# Altium schematic sheet 0001_TITLE.SchDoc
size 848 x 558 mm
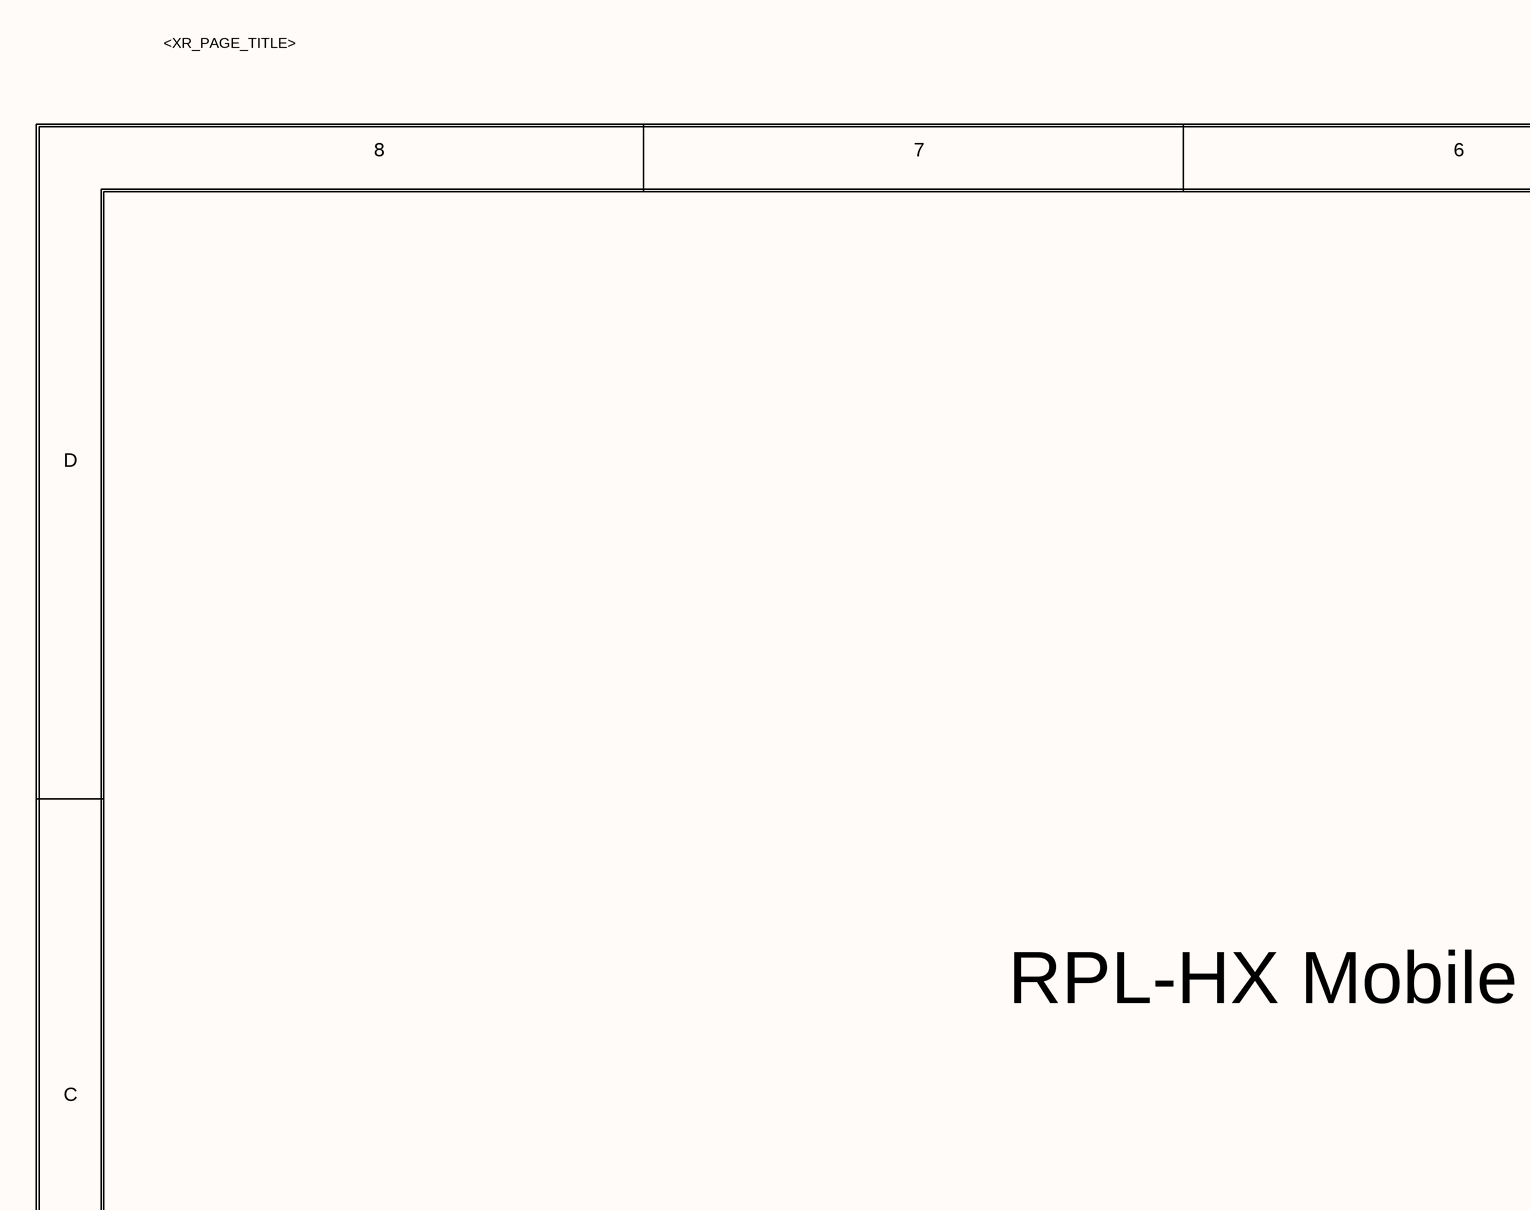
[diagram p0: 0001_TITLE.SchDoc, top left]
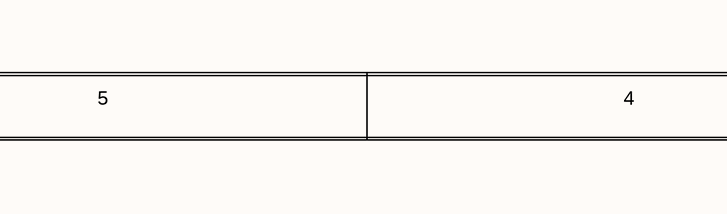
[diagram p1: 0001_TITLE.SchDoc, top middle]
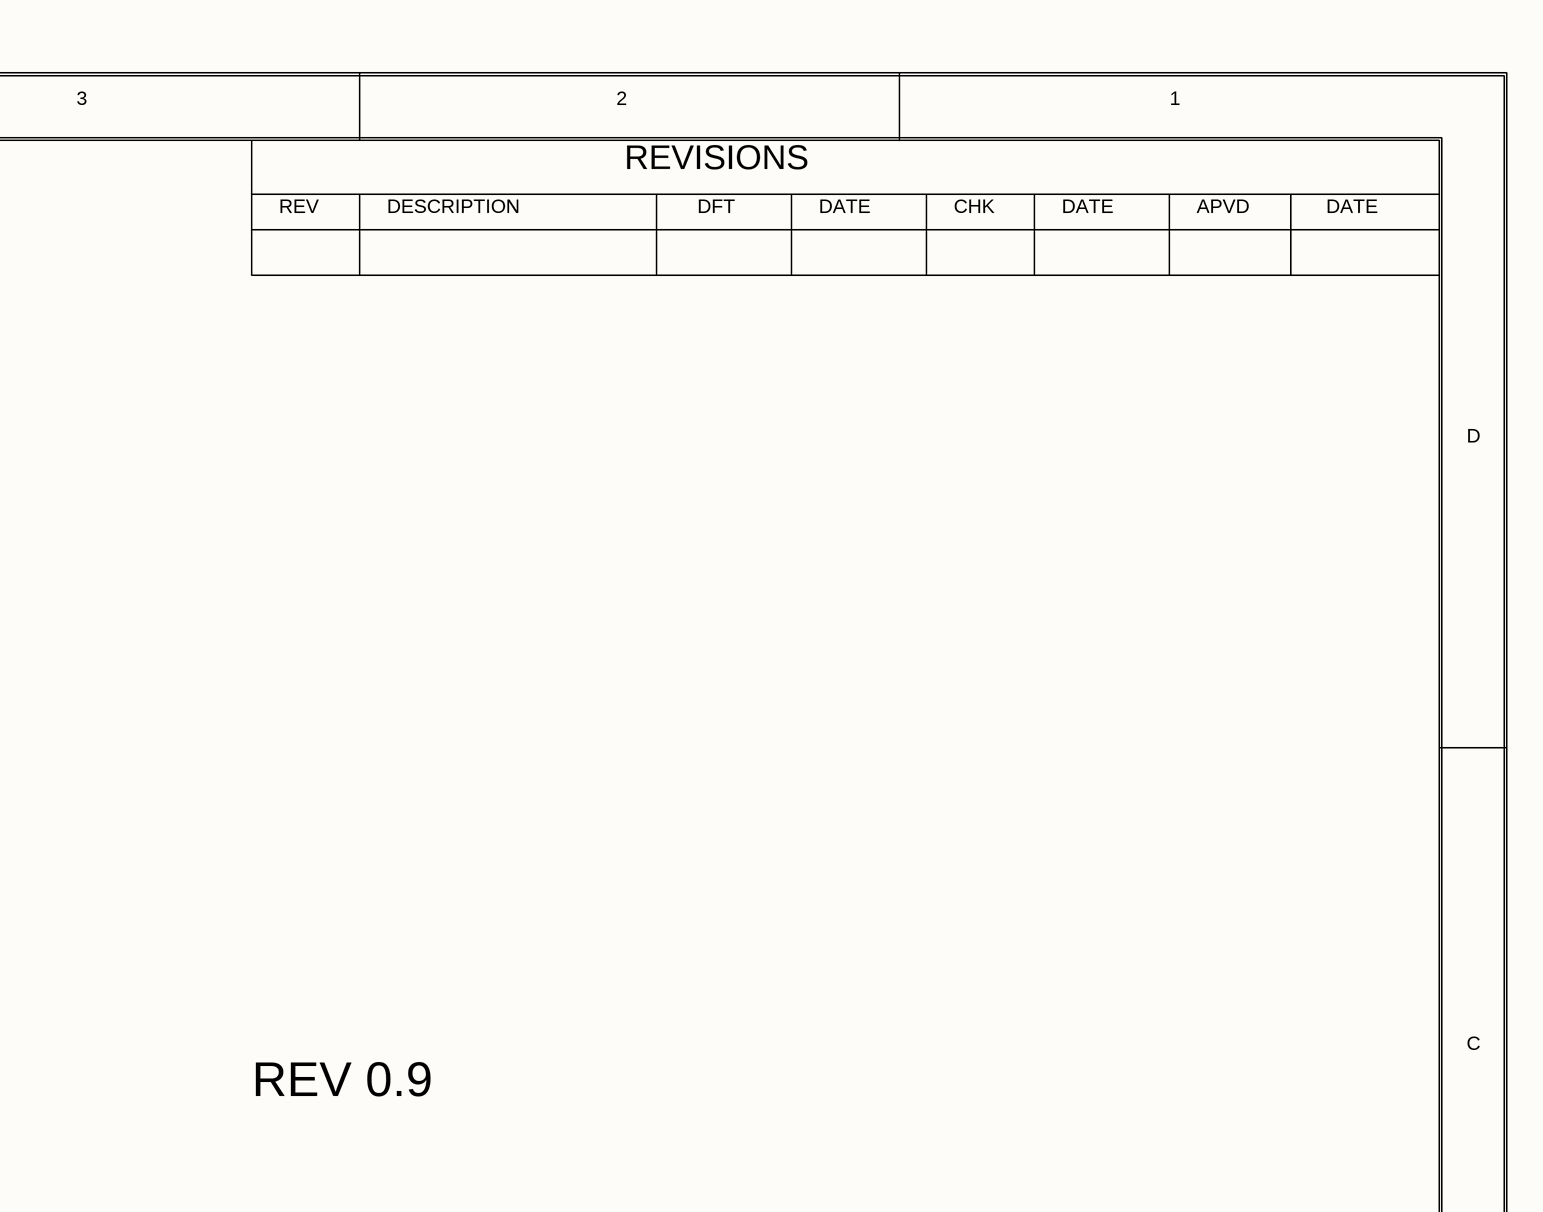
[diagram p2: 0001_TITLE.SchDoc, top right]
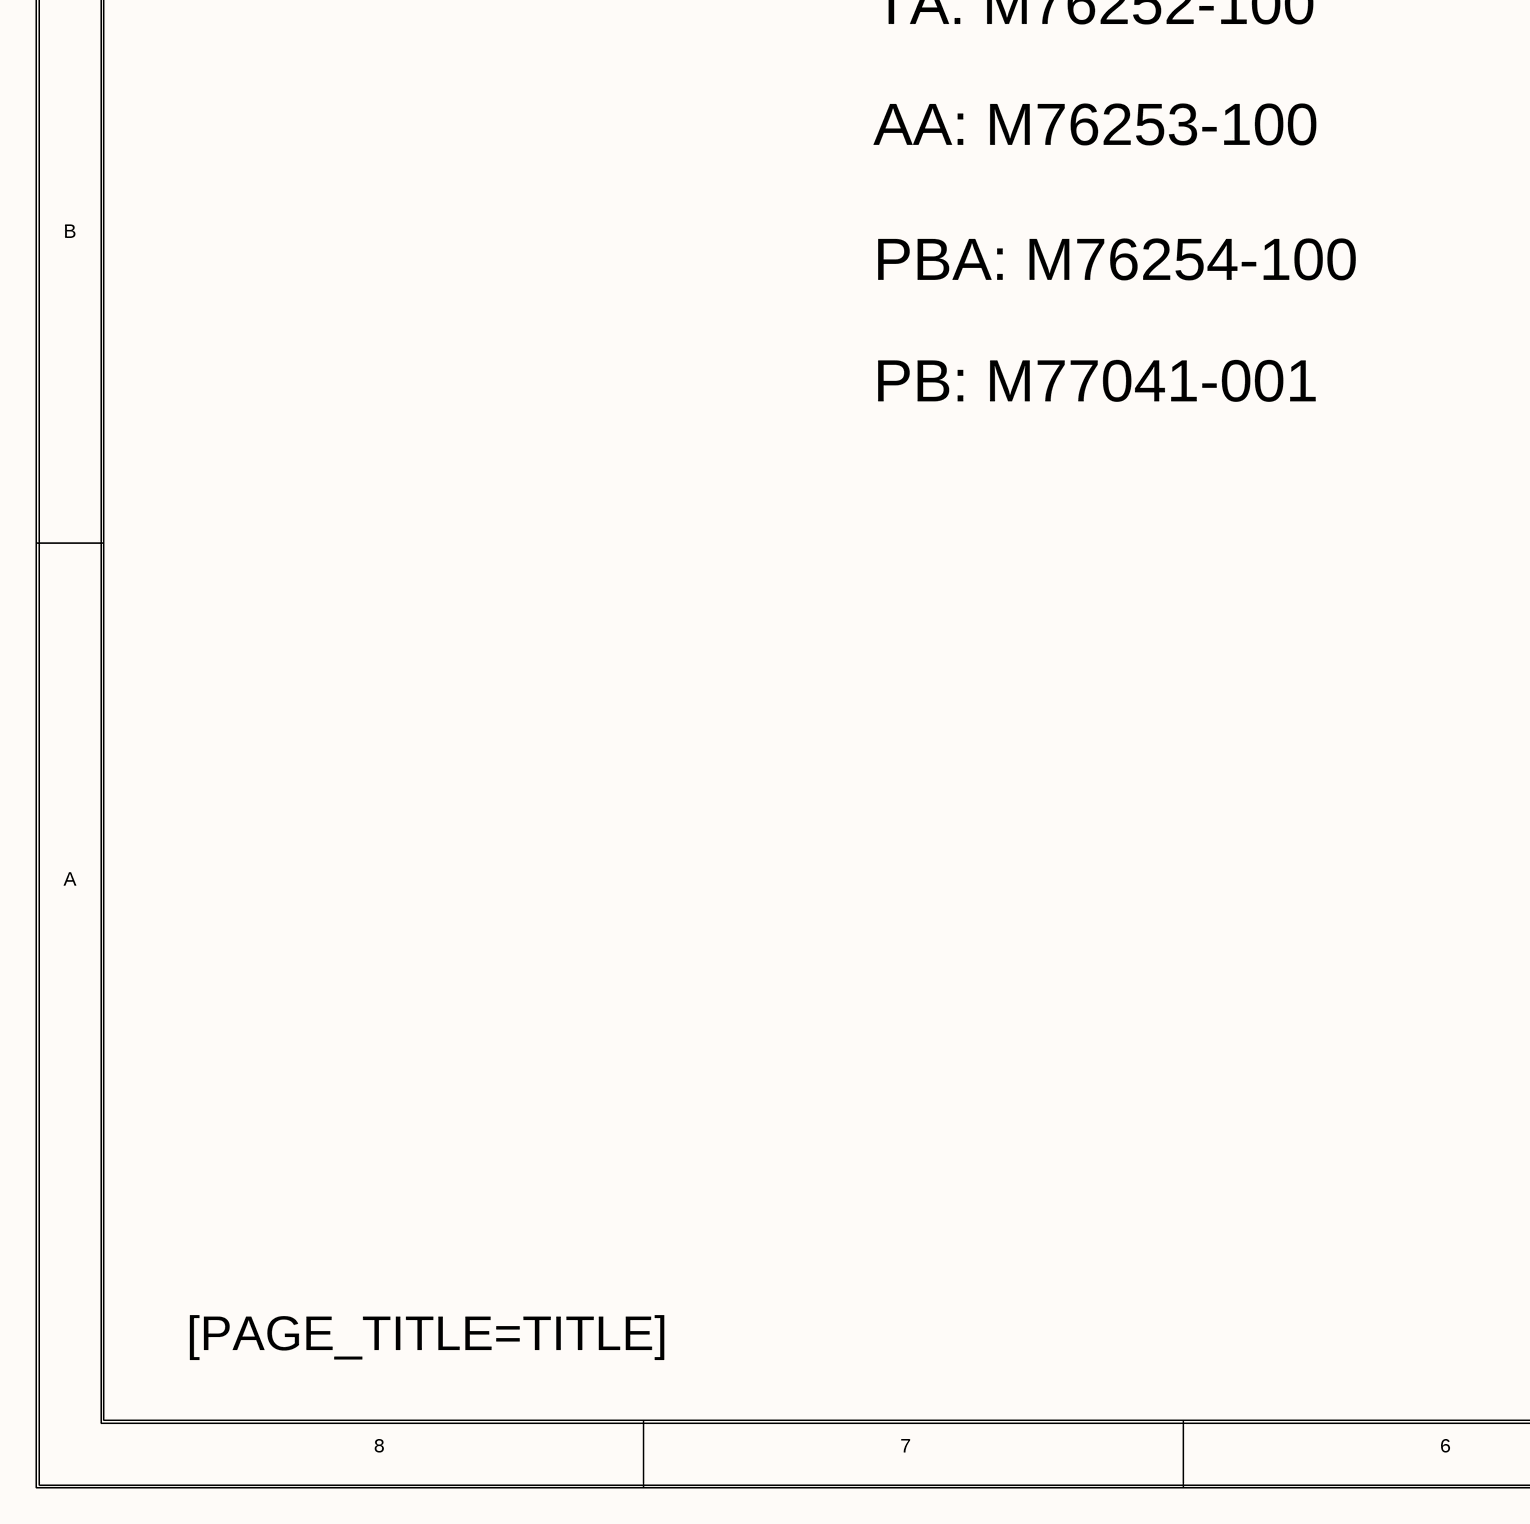
[diagram p3: 0001_TITLE.SchDoc, bottom left]
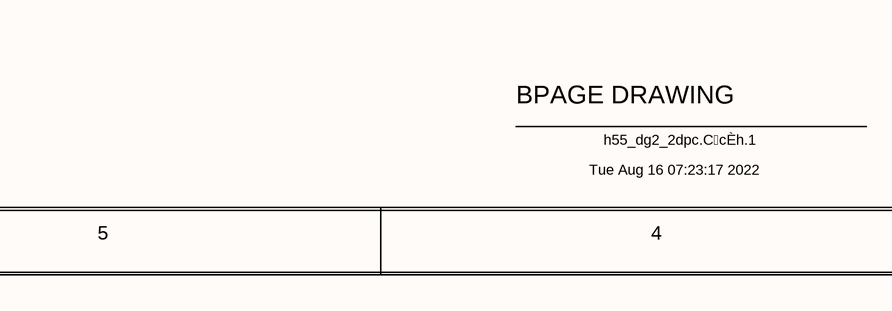
[diagram p4: 0001_TITLE.SchDoc, bottom middle]
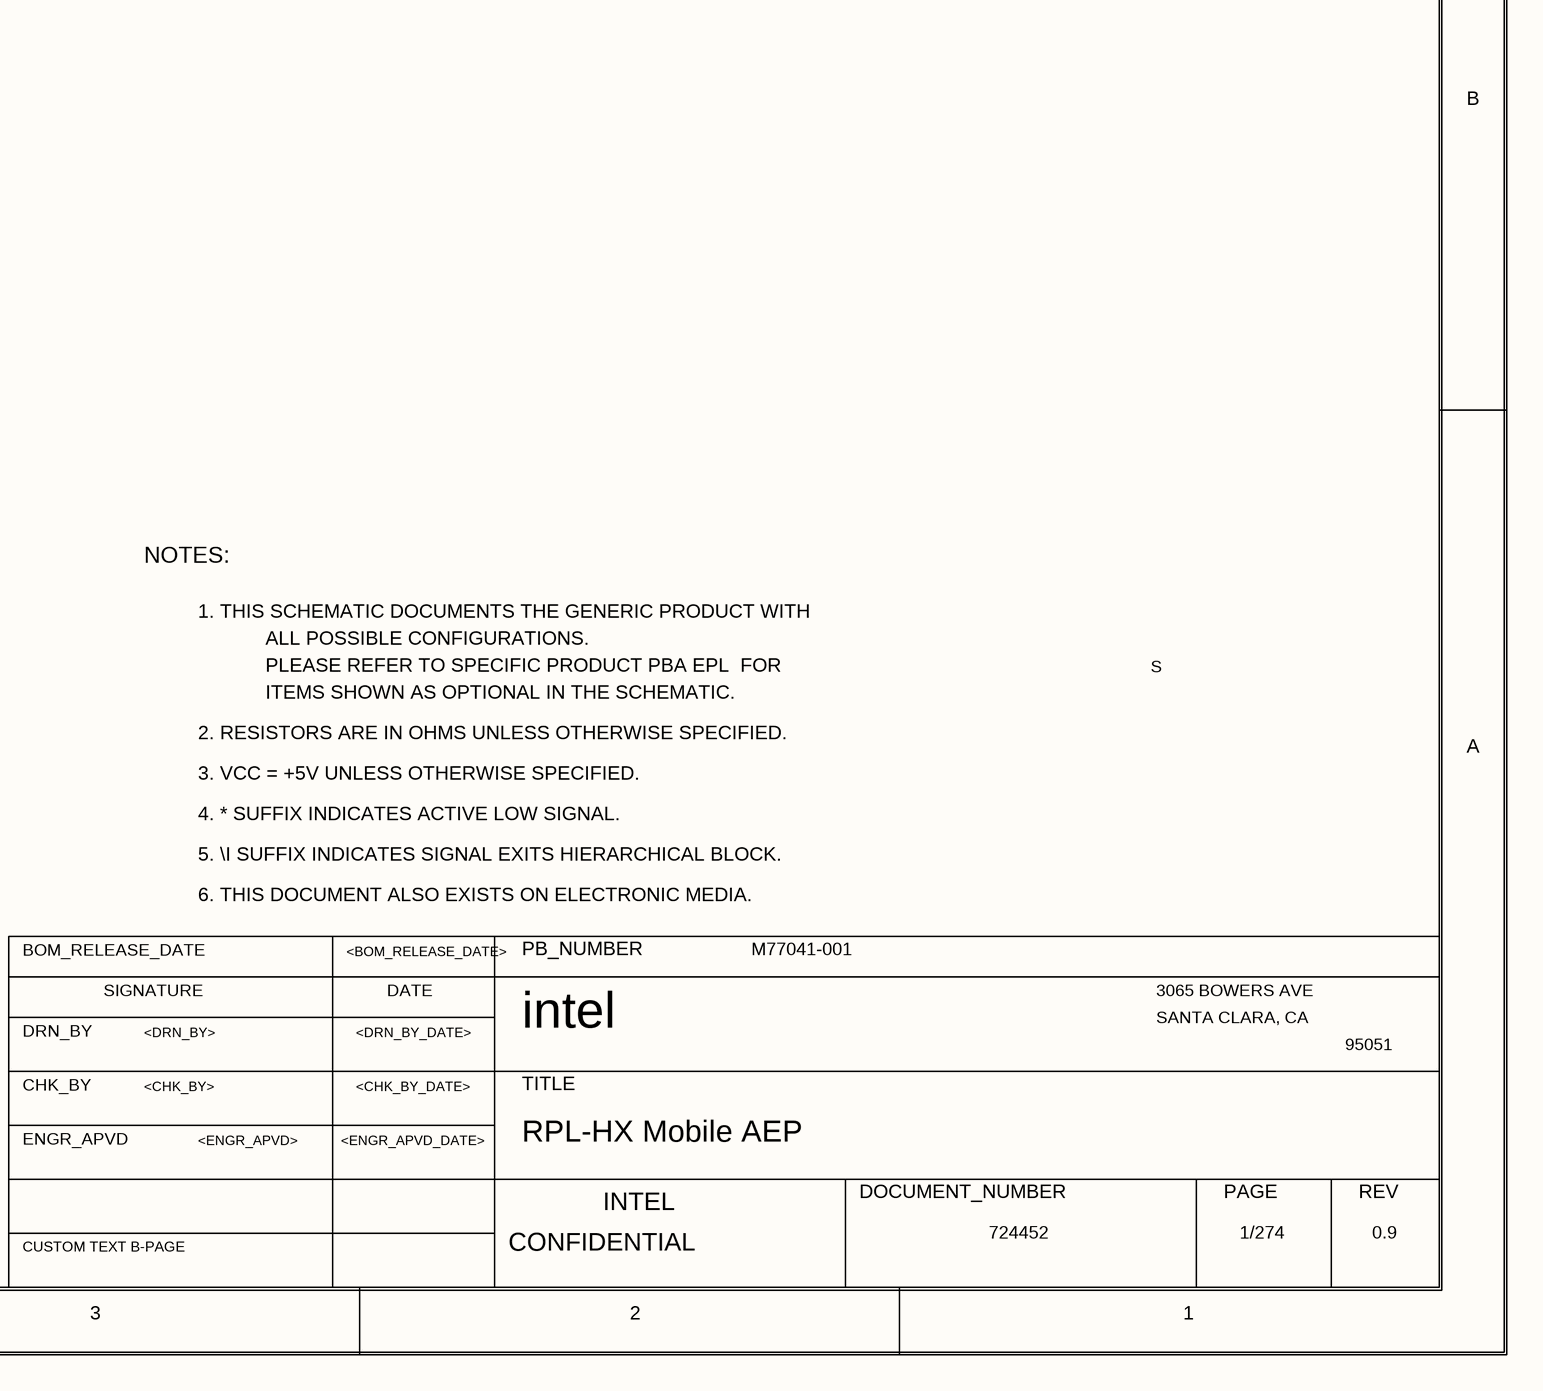
[diagram p5: 0001_TITLE.SchDoc, bottom right]

## Notes on the sheet
- <XR_PAGE_TITLE>
- 8
- 7
- 6
- 5
- 4
- 3
- 2
- 1
- REVISIONS
- REV
- DESCRIPTION
- DFT
- DATE
- CHK
- APVD
- D
- RPL-HX Mobile AEP
- C
- REV 0.9
- TA: M76252-100
- AA: M76253-100
- B
- PBA: M76254-100
- PB: M77041-001
- NOTES:
- 1. THIS SCHEMATIC DOCUMENTS THE GENERIC PRODUCT WITH
- PLEASE REFER TO SPECIFIC PRODUCT PBA EPL  FOR
- ALL POSSIBLE CONFIGURATIONS.
- S
- 2. RESISTORS ARE IN OHMS UNLESS OTHERWISE SPECIFIED.
- ITEMS SHOWN AS OPTIONAL IN THE SCHEMATIC.
- A
- 3. VCC = +5V UNLESS OTHERWISE SPECIFIED.
- 4. * SUFFIX INDICATES ACTIVE LOW SIGNAL.
- 5. \I SUFFIX INDICATES SIGNAL EXITS HIERARCHICAL BLOCK.
- 6. THIS DOCUMENT ALSO EXISTS ON ELECTRONIC MEDIA.
- BOM_RELEASE_DATE
- SIGNATURE
- <BOM_RELEASE_DATE>
- PB_NUMBER
- M77041-001
- 3065 BOWERS AVE
- DRN_BY
- <DRN_BY>
- <DRN_BY_DATE>
- intel
- SANTA CLARA, CA
- 95051
- ENGR_APVD
- CHK_BY
- <CHK_BY>
- <ENGR_APVD>
- <ENGR_APVD_DATE>
- <CHK_BY_DATE>
- TITLE
- BPAGE DRAWING
- INTEL
- DOCUMENT_NUMBER
- PAGE
- [PAGE_TITLE=TITLE]
- Tue Aug 16 07:23:17 2022
- h55_dg2_2dpc.CcÈh.1
- CUSTOM TEXT B-PAGE
- CONFIDENTIAL
- 724452
- 1/274
- 0.9